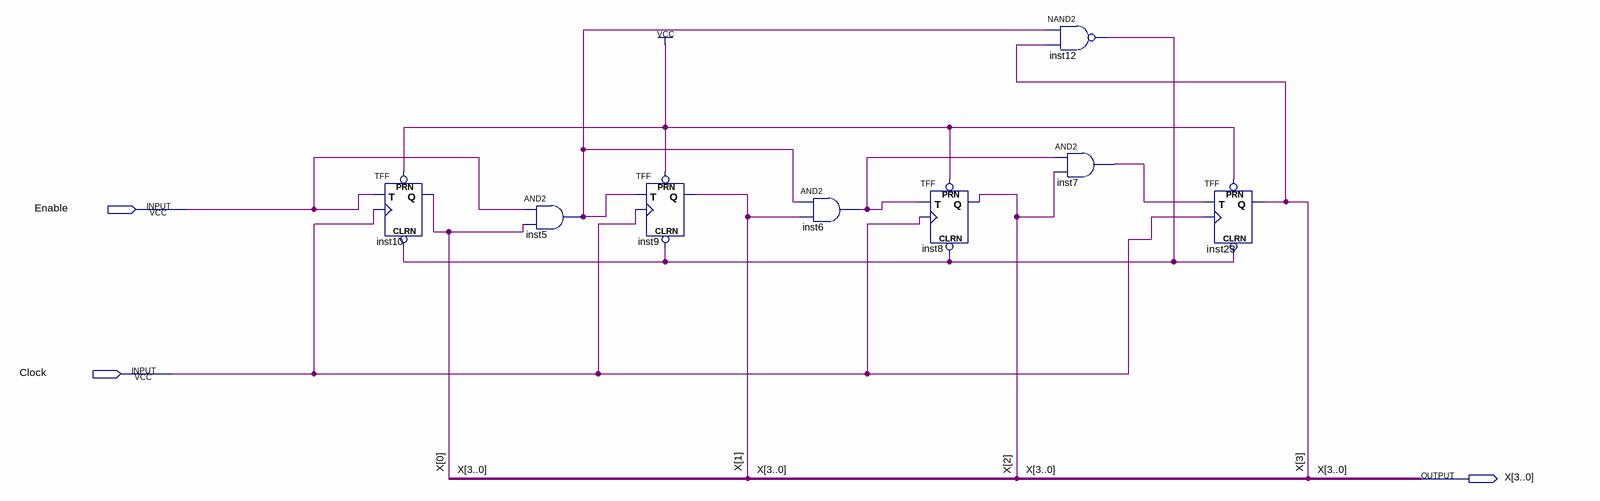
[diagram p0: schematic sheet]
// Quartus schematic testCounter.bdf as structural Verilog: 8 symbols, 3 pins
module testCounter (
  input  Enable,
  input  Clock,
  output [3:0] X
);

  wire inst5_out, inst6_out, inst7_out, inst12_out;

  TFF inst10 (.PRN(1'b1), .CLRN(inst12_out), .T(Enable), .CLK(Clock), .Q(X[0]));
  and inst5 (inst5_out, Enable, X[0]);
  TFF inst9 (.PRN(1'b1), .CLRN(inst12_out), .T(inst5_out), .CLK(Clock), .Q(X[1]));
  and inst6 (inst6_out, inst5_out, X[1]);
  TFF inst8 (.PRN(1'b1), .CLRN(inst12_out), .T(inst6_out), .CLK(Clock), .Q(X[2]));
  nand inst12 (inst12_out, inst5_out, X[3]);
  and inst7 (inst7_out, inst6_out, X[2]);
  TFF inst23 (.PRN(1'b1), .CLRN(inst12_out), .T(inst7_out), .CLK(Clock), .Q(X[3]));
endmodule
